# EAGLE design SNAC  7ch USB3-5v (EAGLE 7.7.0)
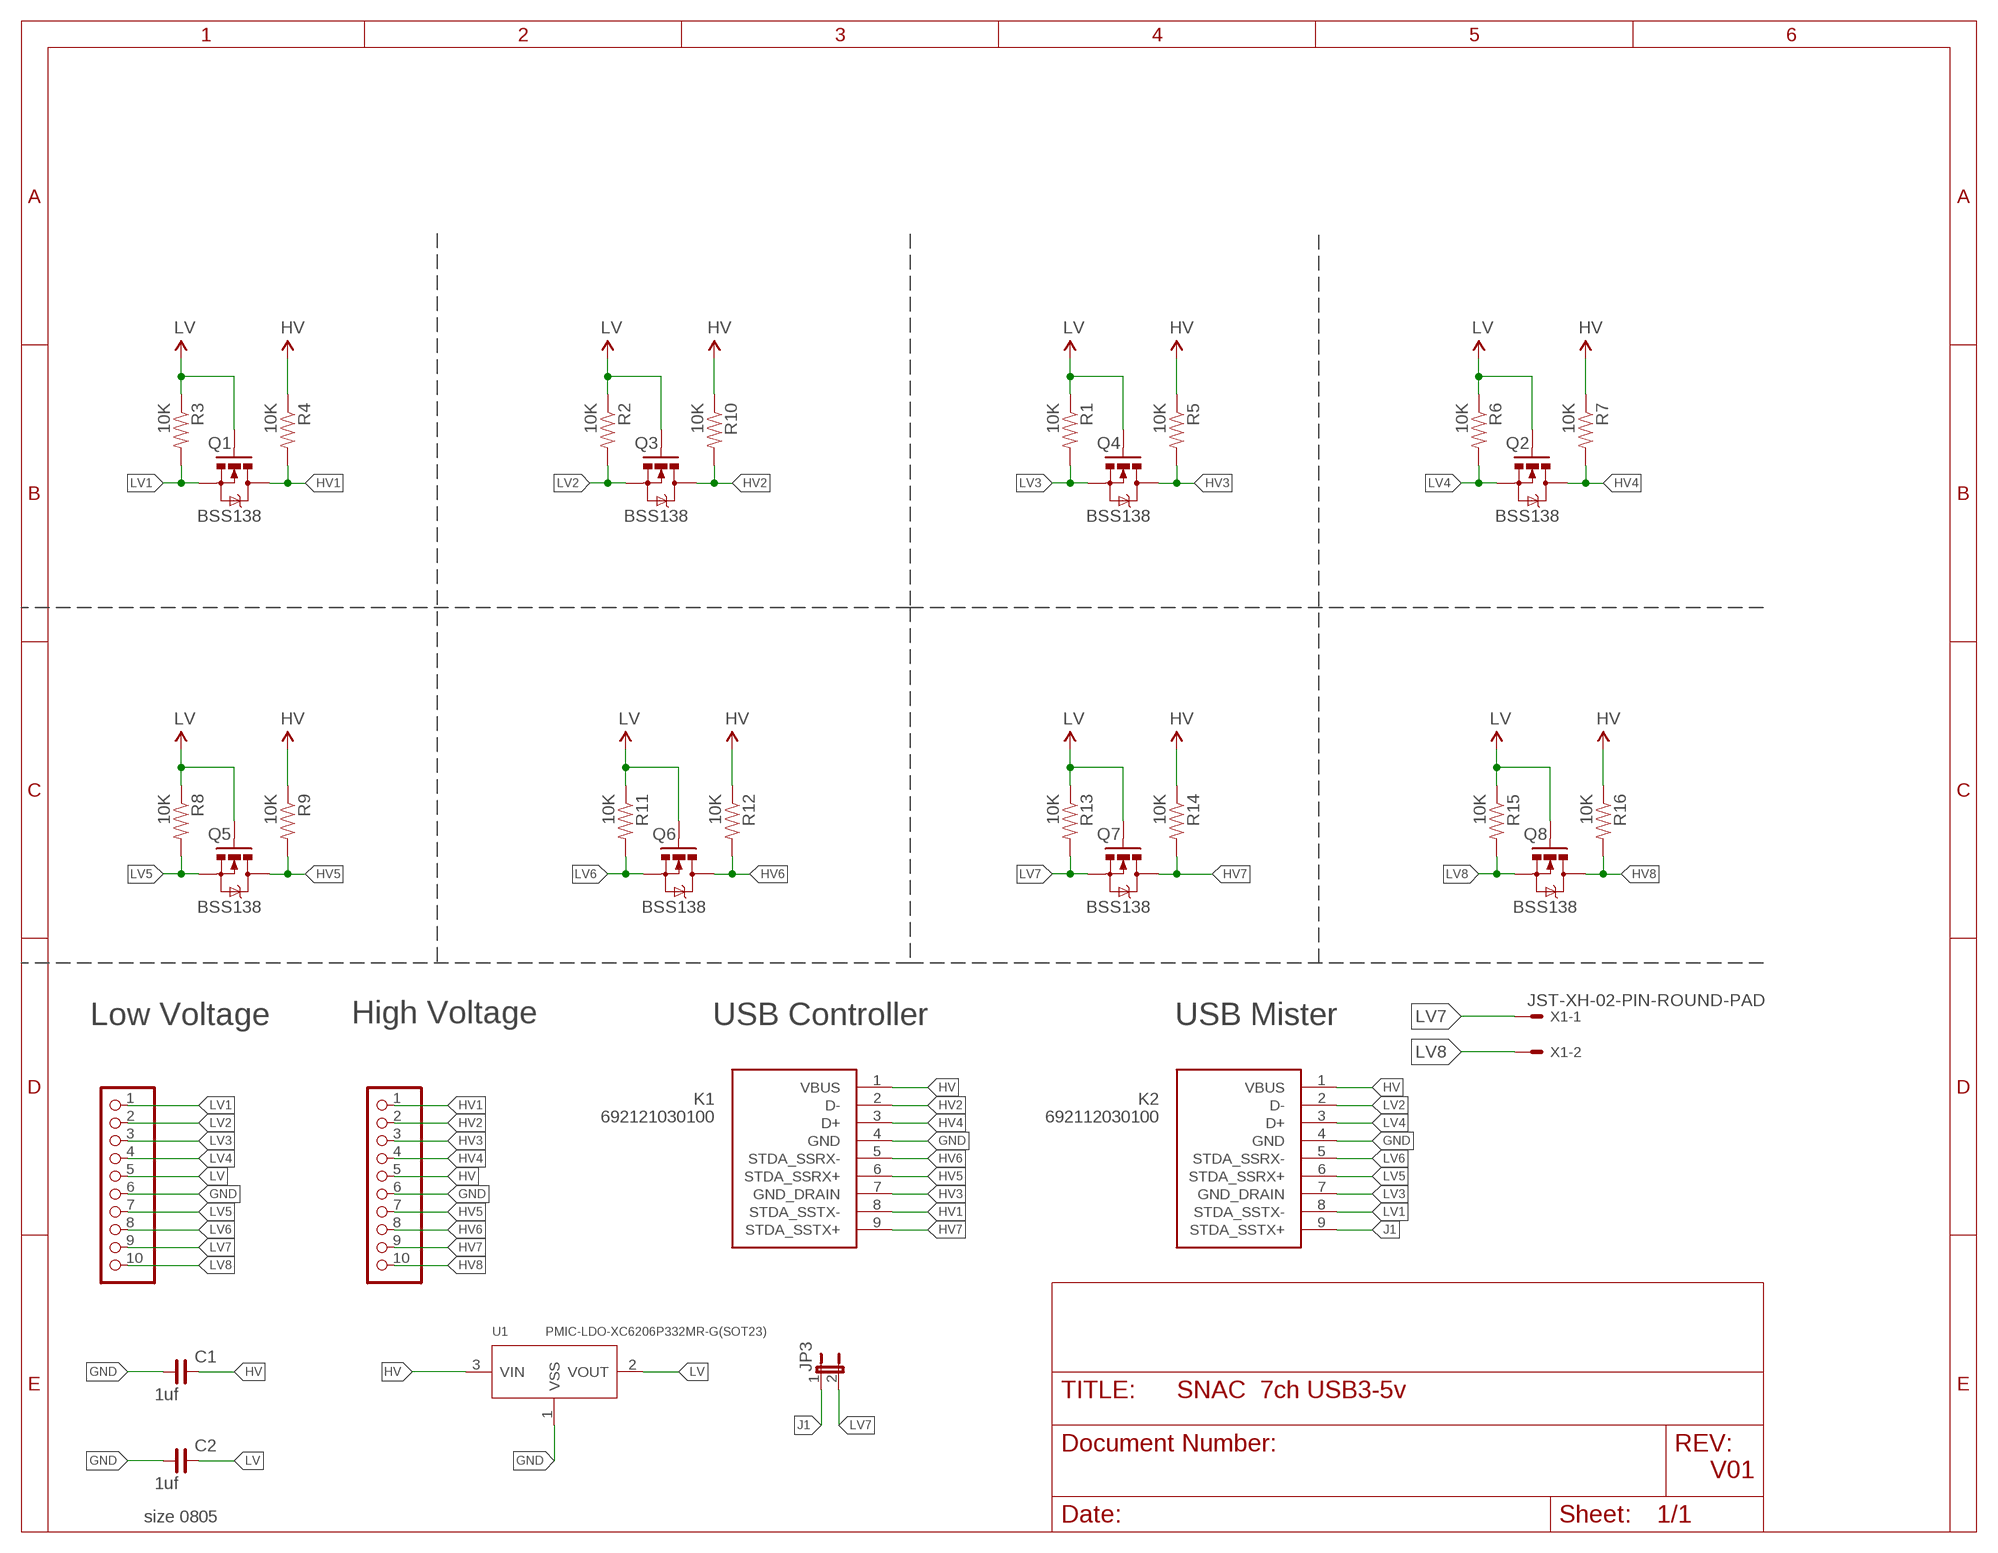
[diagram p0: schematic, sheet 1]

## Parts
C1  1uf  C_0805  [C0805]
C2  1uf  C_0805  [C0805]
JP1  PINHD-1X10_2.54-S  [1X10-S]
JP2  PINHD-1X10_2.54-S  [1X10-S]
JP3  JUMPER-2PTH  [1X02]
K1  692121030100  [692121030100]
K2  692112030100  [692112030100]
Q1  BSS138  MOSFET-NCHANNELSMD  [SOT23-3]
Q2  BSS138  MOSFET-NCHANNELSMD  [SOT23-3]
Q3  BSS138  MOSFET-NCHANNELSMD  [SOT23-3]
Q4  BSS138  MOSFET-NCHANNELSMD  [SOT23-3]
Q5  BSS138  MOSFET-NCHANNELSMD  [SOT23-3]
Q6  BSS138  MOSFET-NCHANNELSMD  [SOT23-3]
Q7  BSS138  MOSFET-NCHANNELSMD  [SOT23-3]
Q8  BSS138  MOSFET-NCHANNELSMD  [SOT23-3]
R1  10K  RESISTOR0603-RES  [0603-RES]
R2  10K  RESISTOR0603-RES  [0603-RES]
R3  10K  RESISTOR0603-RES  [0603-RES]
R4  10K  RESISTOR0603-RES  [0603-RES]
R5  10K  RESISTOR0603-RES  [0603-RES]
R6  10K  RESISTOR0603-RES  [0603-RES]
R7  10K  RESISTOR0603-RES  [0603-RES]
R8  10K  RESISTOR0603-RES  [0603-RES]
R9  10K  RESISTOR0603-RES  [0603-RES]
R10  10K  RESISTOR0603-RES  [0603-RES]
R11  10K  RESISTOR0603-RES  [0603-RES]
R12  10K  RESISTOR0603-RES  [0603-RES]
R13  10K  RESISTOR0603-RES  [0603-RES]
R14  10K  RESISTOR0603-RES  [0603-RES]
R15  10K  RESISTOR0603-RES  [0603-RES]
R16  10K  RESISTOR0603-RES  [0603-RES]
U1  PMIC-LDO-XC6206P332MR-G(SOT23)  [SOT-23]
X1  JST-XH-02-PIN-ROUND-PAD  [JST-XH-02-PACKAGE-ROUND-PAD]

## Nets
GND: C1.1 C2.1 JP1.6 JP2.6 K1.4(GND) K2.4(GND) U1.1(VSS)
HV: C1.2 JP2.5 K1.1(VBUS) K2.1(VBUS) R4.1 R5.1 R7.1 R9.1 R10.1 R12.1 R14.1 R16.1 U1.3(VIN)
HV1: JP2.1 K1.8(STDA_SSTX-) Q1.3(D) R4.2
HV2: JP2.2 K1.2(D-) Q3.3(D) R10.2
HV3: JP2.3 K1.7(GND_DRAIN) Q4.3(D) R5.2
HV4: JP2.4 K1.3(D+) Q2.3(D) R7.2
HV5: JP2.7 K1.6(STDA_SSRX+) Q5.3(D) R9.2
HV6: JP2.8 K1.5(STDA_SSRX-) Q6.3(D) R12.2
HV7: JP2.9 K1.9(STDA_SSTX+) Q7.3(D) R14.2
HV8: JP2.10 Q8.3(D) R16.2
J1: JP3.1 K2.9(STDA_SSTX+)
LV: C2.2 JP1.5 Q1.1(G) Q2.1(G) Q3.1(G) Q4.1(G) Q5.1(G) Q6.1(G) Q7.1(G) Q8.1(G) R1.1 R2.1 R3.1 R6.1 R8.1 R11.1 R13.1 R15.1 U1.2(VOUT)
LV1: JP1.1 K2.8(STDA_SSTX-) Q1.2(S) R3.2
LV2: JP1.2 K2.2(D-) Q3.2(S) R2.2
LV3: JP1.3 K2.7(GND_DRAIN) Q4.2(S) R1.2
LV4: JP1.4 K2.3(D+) Q2.2(S) R6.2
LV5: JP1.7 K2.6(STDA_SSRX+) Q5.2(S) R8.2
LV6: JP1.8 K2.5(STDA_SSRX-) Q6.2(S) R11.2
LV7: JP1.9 JP3.2 Q7.2(S) R13.2 X1.1
LV8: JP1.10 Q8.2(S) R15.2 X1.2

## Notes on the sheet
- Low Voltage | High Voltage | USB Controller | USB Mister
- V01
- size 0805

## Library data of the parts
C1 C2 = rc-master-smd:C_: NON-POLARIZED CAP
JP1 JP2 = pinhead-2:PINHD-1X10: PIN HEADER
JP3 = SparkFun:JUMPER-2: Jumper Basic 0.1" spaced jumper. Use with breakaway headers.
K1 = Wuerth_Elektronik_eiCan_Communication_Connectors_STENCIL:692121030100: WR-COM USB 3.0 HORIZONTAL TYPE A
K2 = Wuerth_Elektronik_eiCan_Communication_Connectors_STENCIL:692112030100: WR-COM USB 3.0 SMT PLUG WITH CLIPTYPE A
Q1-Q8 = SparkFun:MOSFET-NCHANNEL
R1-R16 = SparkFun:RESISTOR: Resistor Basic schematic elements and footprints for 0603, 1206, and PTH resistors.
U1 = PMIC-LDO-XC6206P332MR-G_SOT23_:PMIC-LDO-XC6206P332MR-G(SOT23): 310030099; AVAILABILITY: Unavailable; DESCRIPTION: SMD PMIC; LDO; Vin 6V; 3.3V; 200mA; Without En; 1-Ch; MF: Torex; MP: XC6206P332MR-G; PACKAGE: SOT-23-3 Torex; PRICE: None
X1 = Rembrandt Electronics - JST XH Connectors v1-0:JST-XH-02-PIN: JST XH Connector 2 Pin Wire to board connector. Pitch: 2,54 mm, (0.100") Number of pins: 2 Created by Rembrandt Electronics www.rembrandtelectronics.com

## Board
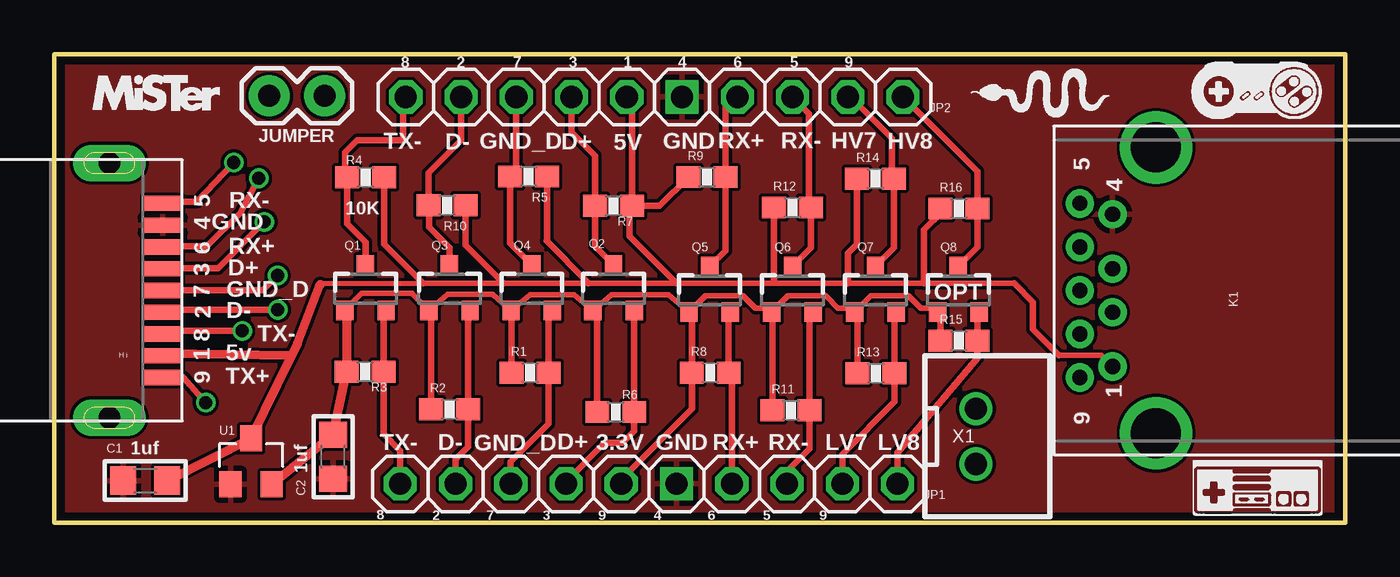
[diagram p1: board, top side]
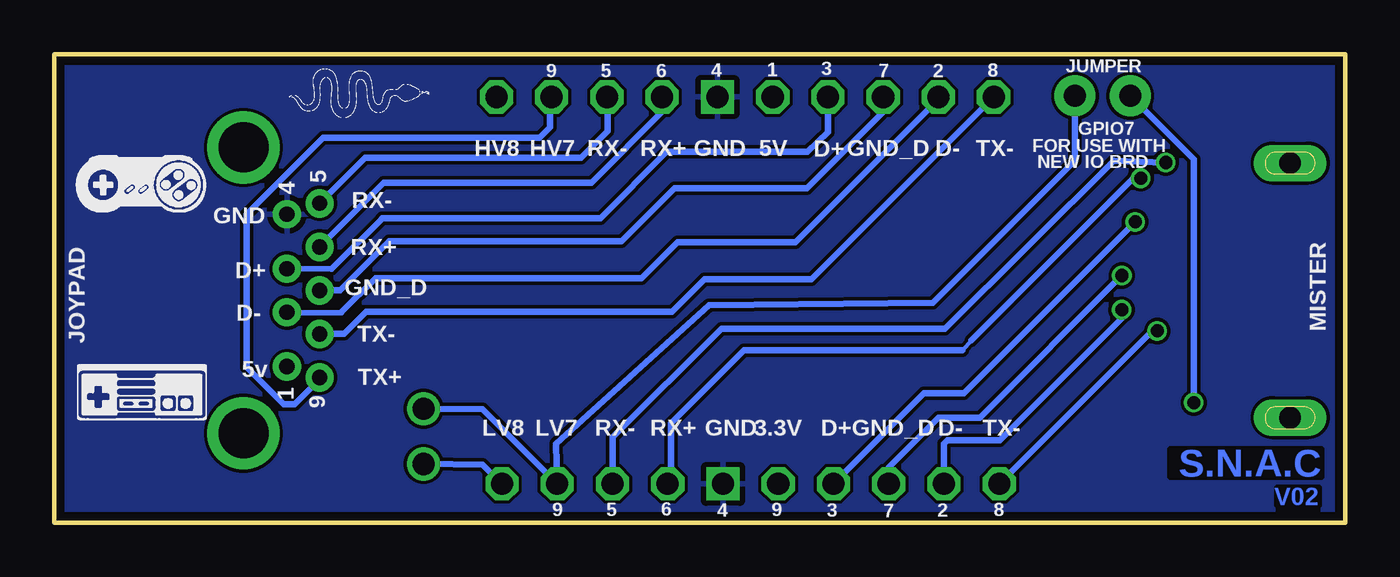
[diagram p2: board, bottom side, seen from below]

Size 59.33 x 21.51 mm. Coordinates in mm from the lower left corner, seen from the top.
Outline: 0,0 59.33,0 59.33,21.51 0,21.51 0,0
Copper layers (1*16): Top 0.035559375mm / dielectric 1.6mm / Bottom 0.035559375mm
Design rules "oshpark-2layer": minimum track width 6mil, minimum drill 10mil, track to track 6mil, track to pad 6mil, pad to pad 6mil, via to via 6mil, smd to smd 6mil, copper to edge 15mil, drill to drill 6mil, minimum pad ring 5mil, minimum via ring 5mil, stop-mask expansion 2.5mil, vias tented up to drill 0mil, thermal gap 10mil

### Footprints (pad centres in the part's own frame; a part is rotated, then mirrored left to right if it is on the bottom)
C0805 = smd 1.2 x 1.3: 1 -1.016,0; 2 1.016,0
1X10-S = drill 1.016 octagon: 1 -11.43,0; 2 -8.89,0; 3 -6.35,0; 4 -3.81,0; 5 -1.27,0; 7 3.81,0; 8 6.35,0; 9 8.89,0; 10 11.43,0 | drill 1.016 square: 6 1.27,0
1X02 = drill 1.016 pad 1.88: 1 0,0; 2 2.54,0
692121030100 = drill 0.7 pad 1.3: 1 3.5,1.5; 2 1,1.5; 3 -1,1.5; 4 -3.5,1.5; 5 -4,0; 6 -2,0; 7 0,0; 8 2,0; 9 4,0 | drill 2.3 pad 3.3: Z1 -6.57,3.5; Z2 6.57,3.5
692112030100 = smd 0.7 x 1.8: 1 -3,0; 2 -1,0; 3 1,0; 4 3,0; 5 4,0; 6 2,0; 7 0,0; 8 -2,0; 9 -4,0 | drill 1 pad 1.676 long: Z1 5.85,2.45; Z2 -5.85,2.45
SOT23-3 = smd 0.8 x 0.9: 1 -0.95,-1; 2 0.95,-1; 3 0,1.1
0603-RES = smd 1.1 x 1: 1 -0.85,0; 2 0.85,0
SOT-23 = smd 1.016 x 1.2: 1 -0.95,-1.06; 2 0.95,-1.06; 3 0,1.06
JST-XH-02-PACKAGE-ROUND-PAD = drill 1.016: 1 -1.27,0; 2 1.27,0

### Placement (x,y rotation side)
C1  4.18,1.93 0 top
C2  12.81,3.02 90 top
JP1  27.33,1.78 0 top
JP2  27.58,19.56 0 top
JP3  9.88,19.61 0 top
K1  47.14,10.67 270 top
K2  4.98,10.67 90 top
Q1  14.3,10.74 0 top
Q2  25.7,10.74 0 top
Q3  18.16,10.74 0 top
Q4  21.95,10.74 0 top
Q5  30.12,10.67 0 top
Q6  33.93,10.67 0 top
Q7  37.74,10.67 0 top
Q8  41.55,10.67 0 top
R1  21.87,6.88 0 top
R2  18.16,5.21 0 top
R3  14.27,6.93 0 top
R4  14.3,15.87 180 top
R5  21.79,15.9 180 top
R6  25.81,5.08 0 top
R7  25.7,14.55 180 top
R8  30.15,6.88 0 top
R9  30,15.88 0 top
R10  18.06,14.58 180 top
R11  33.86,5.16 0 top
R12  33.93,14.48 0 top
R13  37.77,6.86 0 top
R14  37.74,15.8 0 top
R15  41.58,8.36 0 top
R16  41.58,14.43 0 top
U1  9.04,2.82 0 top
X1  42.37,3.96 270 top

### Tracks (layer width: path | path; a pad name or v marks a point on that pad's centre or on a via)
GND
  pour Top: -0.03,21.51 59.23,21.49 59.36,-0.05 0,0
  pour Bottom: -0.03,21.49 59.28,21.56 59.36,-0.05 -0.03,0
HV
  Top 0.178: 5.06,7.75 K2.1 | 12.22,10.95 12.19,10.97 | 15.2,12.74 15.15,12.8 | 22.62,12.94 22.64,12.96 | JP2.5 26.55,19.32 | R7.1 26.44,14.44 | 33.08,11.04 33.05,11 | R16.1 40.84,14.31
  Top 0.254: 46.18,7.68 48.13,7.68 K1.1 | 12.19,10.97 16.95,11 20.65,11 24.56,11 28.6,11 33.05,11 36.47,11 39.98,11 44.12,11
  Top 0.305: 46.18,7.68 44.98,8.88 44.98,10.13 44.12,11 | 22.62,12.94 24.56,11 | 20.65,11 18.91,12.73 R10.1 | 15.2,12.74 16.95,11 | 15.15,12.8 R4.1 | 22.64,12.96 R5.1 | 26.55,19.32 R7.1 27.83,14.55 R9.1 | 26.44,14.44 26.44,13.16 28.6,11 | R12.1 33.08,11.04 | R14.1 36.89,12.79 36.47,12.37 36.47,11 | 40.84,14.31 39.98,13.45 39.98,11
  Top 0.406: 10.9,7.67 11.18,8.23 12.22,10.95 | 10.9,7.67 5.06,7.75 | C1.2 U1.3 10.9,7.67
HV1
  Top 0.178: 16.03,19.56 JP2.1 | 13.36,15.96 R4.2
  Top 0.305: 16.03,19.56 16.03,17.58 13.92,17.58 13.36,17.02 13.36,15.96 | Q1.3 14.3,12.88 13.45,13.73 R4.2
  Bottom 0.305: JP2.1 24.54,11.18 29.44,11.18 30.94,9.68 45.01,9.68 46.02,8.67 K1.8
HV2
  Top 0.178: 17.2,16.08 17.21,16.07 | 17.22,14.57 R10.2
  Top 0.305: JP2.2 18.69,17.58 17.2,16.08 | 17.21,16.07 R10.2 | Q3.3 18.16,12.62 17.22,13.56 17.22,14.57
  Bottom 0.178: 48.63,9.65 K1.2 | JP2.2 18.69,19.46 | 46.13,9.68 46.13,9.65
  Bottom 0.254: 48.63,9.65 46.13,9.65
  Bottom 0.305: 18.69,19.46 25.27,12.88 30.68,12.88 32.33,11.23 44.58,11.23 46.13,9.68
HV3
  Top 0.178: 21.17,19.56 JP2.3 | Q4.3 21.95,12.17 | R5.2 21.23,16.19
  Top 0.305: 21.23,16.19 JP2.3 | R5.2 20.94,12.85 Q4.3
  Bottom 0.178: 47.12,10.64 K1.7
  Bottom 0.305: JP2.3 21.23,18.87 24.74,15.37 30.84,15.37 33.27,12.93 43.94,12.93 46.2,10.67 K1.7
HV4
  Top 0.305: JP2.4 23.77,17.93 24.85,16.85 R7.2 24.85,12.69 Q2.3
  Bottom 0.178: 23.77,19.68 JP2.4 | 44.27,13.99 44.27,13.97 | K1.3
  Bottom 0.254: 46.58,11.66 K1.3
  Bottom 0.305: 44.27,13.99 34.24,13.99 31.19,17.04 24.71,17.04 23.77,17.93 JP2.4 | 44.27,13.97 46.58,11.66
HV5
  Top 0.178: 31.27,19.56 JP2.7
  Top 0.305: Q5.3 30.85,12.49 R9.2 30.85,19.14 31.27,19.56
  Bottom 0.178: 31.29,19.46 JP2.7
  Bottom 0.305: K1.6 44.19,15.62 34.65,15.62 31.39,18.87 JP2.7
HV6
  Top 0.178: 34.7,14.57 R12.2
  Top 0.305: JP2.8 34.7,18.8 34.7,14.57 | Q6.3 34.78,12.62 R12.2
  Bottom 0.178: JP2.8 33.91,19.53
  Bottom 0.305: K1.5 45.05,16.76 35.13,16.76 33.91,17.98 33.91,19.53
HV7
  Top 0.178: 36.6,19.56 JP2.9 | 38.51,15.89 R14.2
  Top 0.305: 36.6,19.56 38.51,17.65 38.51,15.89 | Q7.3 38.59,12.62 R14.2
  Bottom 0.305: K1.9 47.14,6.58 48.29,5.44 48.79,5.44 50.5,7.14 50.5,14.17 46.99,17.68 37.03,17.68 36.55,18.16 36.55,19.48 JP2.9
HV8
  Top 0.305: Q8.3 42.43,12.64 R16.2 42.43,16.14 JP2.10
J1  (via drill 0.6)
  Top 0.305: K2.9 5.93,6.67 v6.96,5.51
  Bottom 0.305: v6.96,5.51 6.96,16.69 JP3.1
LV
  Top 0.178: 24.85,9.84 Q2.1 | 17.14,9.74 Q3.1 17.34,9.62 17.31,9.59 | Q2.1 | 33.17,9.84 33.16,9.84 Q6.1 | Q8.1 | 40.43,9.84 Q8.1 | 36.62,9.84 Q7.1 | 33.08,9.57 Q6.1 | 32.81,9.84 Q6.1 | Q2.1 24.66,9.65 24.96,9.36 | 29.24,9.73 Q5.1 29.3,9.54 | JP1.5 26.06,1.98 | Q4.1 21.1,9.64 21.02,9.57 | 16.43,10.53 16.43,10.52 | Q8.1 | Q1.1 13.42,9.67 | 29.3,7.39 R8.1 | 29.29,5.21 29.3,5.22 | 33.01,9.64 Q6.1
  Top 0.254: 16.43,10.53 14.13,10.53 Q1.1 | 40.43,9.84 39.84,9.84 39.27,10.41 37.54,10.41 Q7.1 | 36.62,9.84 36.03,9.84 35.46,10.41 33.73,10.41 33.16,9.84 | 32.81,9.84 32.22,9.84 31.65,10.41 29.92,10.41 Q5.1 28.24,10.48 25.62,10.48 Q2.1 23.89,10.48 21.86,10.48 Q4.1 20.14,10.5 18.07,10.5 Q3.1 16.43,10.52
  Top 0.305: 26.06,1.98 29.29,5.21 | 17.31,9.59 R2.1 | 21.02,9.57 R1.1 | 24.96,9.36 R6.1 | 29.3,9.54 29.3,7.39 | 29.3,5.22 R8.1 | R11.1 33.01,9.64 | 40.73,9.66 R15.1 | 36.92,9.67 R13.1
  Top 0.406: 13.42,9.67 R3.1 C2.2 U1.2 | Q8.1 40.73,9.66 | Q7.1 36.92,9.67
LV1  (via drill 0.6)
  Top 0.178: K2.8 4.98,8.64 5.15,8.81 | Q1.2 15.12,9.62
  Top 0.305: JP1.1 15.9,3.3 15.12,4.08 R3.2 15.12,9.62 | 5.15,8.81 v8.64,8.81
  Bottom 0.305: JP1.1 8.87,8.81 v8.64,8.81
LV2  (via drill 0.6)
  Top 0.178: 4.98,9.65 K2.2 5.09,9.78 | Q3.2 19.01,9.64
  Top 0.305: JP1.2 18.44,2.92 19.01,3.49 R2.2 19.01,9.64 | 5.09,9.78 v10.27,9.78
  Bottom 0.178: 15.85,3.79 15.88,3.79
  Bottom 0.305: v10.27,9.78 10.27,9.39 15.88,3.79 18.29,3.79 18.44,3.63 JP1.2
LV3  (via drill 0.6)
  Top 0.178: Q4.2 22.72,9.57
  Top 0.305: K2.7 9.58,10.67 v10.26,11.35 | JP1.3 20.98,2.79 22.72,4.53 R1.2 22.72,9.57
  Bottom 0.178: 20.98,2.54 JP1.3
  Bottom 0.305: 20.98,2.54 18.69,4.83 16.79,4.83 v10.26,11.35
LV4  (via drill 0.6)
  Top 0.178: 4.98,11.68 K2.3 | JP1.4 23.52,1.88 | Q2.2 26.63,9.72 26.66,9.7 | 26.66,5.02 R6.2
  Top 0.305: 4.98,11.68 7.52,11.68 v9.65,13.82 | 26.66,9.7 R6.2 26.66,4.2 26.11,3.66 25.3,3.66 23.52,1.88
  Bottom 0.305: JP1.4 19.35,5.94 17.53,5.94 v9.65,13.82
LV5  (via drill 0.6)
  Top 0.178: 4.98,12.7 K2.6 | Q5.2 31,9.59 | R8.2 31.14,6.74
  Top 0.305: 4.98,12.7 7.01,12.7 8.53,14.22 v9.4,15.82 | 31,9.59 R8.2 | 31.14,6.74 JP1.7
  Bottom 0.178: 30.99,1.93 JP1.7 | 17.17,8.38 17.17,8.36 17.6,7.92
  Bottom 0.305: 17.17,8.38 9.55,16 9.32,15.8 v9.4,15.82 | 30.99,1.93 30.99,4.57 27.64,7.92 17.6,7.92
LV6  (via drill 0.6)
  Top 0.178: 4.98,14.73 K2.5 | Q6.2 34.7,9.48 34.71,9.47 | 6.55,14.73 6.55,14.74
  Top 0.305: 4.98,14.73 6.55,14.73 | 6.55,14.74 v8.25,16.55 | 34.71,9.47 R11.2 34.71,3.39 33.68,2.36 JP1.8
  Bottom 0.305: JP1.8 33.68,3.91 28.68,8.91 18.39,8.91 10.63,16.62 v8.25,16.55
LV7
  Top 0.178: Q7.2 38.62,9.59
  Top 0.305: JP1.9 36.22,3.15 38.62,5.55 R13.2 38.62,9.59
  Bottom 0.305: JP3.2 12.42,16.64 18.95,10.11 29.24,9.98 36.27,3.63 JP1.9 39.65,5.21 X1.1
LV8
  Top 0.178: 42.32,9.48 Q8.2
  Top 0.305: JP1.10 38.76,3.2 42.43,7.56 R15.2 42.43,9.48
  Top 0.406: 42.32,9.48 42.43,9.48
  Bottom 0.305: JP1.10 39.65,2.67 X1.2

### Text on the board
Bottom: S.N.A.C | V02
tPlace: 8 | 2 | 7 | 3 | 1 | 4 | 6 | 5 | 9 | RX+ | RX- | HV7 | HV8 | JUMPER | TX- | D- | GND_D | D+ | 5V | GND | 5 | 5 | 4 | RX- | 10K | 4 | GND | 6 | RX+ | 3 | D+ | OPT | 7 | GND_D | 2 | D- | H i | 8 | TX- | 1 | 5v | 9 | TX+ | 1 | 9 | 1uf | TX- | D- | GND_D | D+ | 3.3V | GND | RX+ | RX- | LV7 | LV8 | 1uf | 8 | 2 | 7 | 3 | 9 | 4 | 6 | 5 | 9
bPlace: JUMPER | 3 | 8 | 2 | 7 | 1 | 4 | 6 | 5 | 9 | GPIO7 | FOR USE WITH | TX- | D- | GND_D | D+ | 5V | GND | RX+ | RX- | HV7 | HV8 | NEW IO BRD | 5 | 4 | GND | RX- | MISTER | RX+ | JOYPAD | GND_D | D+ | TX- | D- | TX+ | 5v | 9 | 1 | TX- | D- | GND_D | D+ | 3.3V | GND | RX+ | RX- | LV7 | LV8 | 8 | 2 | 7 | 3 | 9 | 4 | 6 | 5 | 9
tValues: + | -